# Altium schematic sheet Encoder.SchDoc
size A
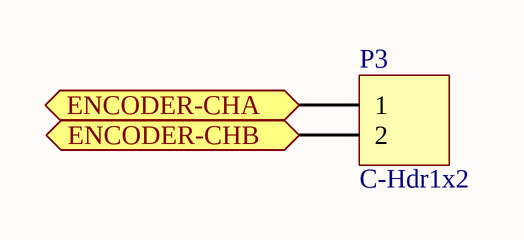
[diagram p0: Encoder.SchDoc]

## Parts
P3  C-Hdr1x2  [HDR1X2_LGE1.0]

## Ports
ENCODER-CHA (out), ENCODER-CHB (out)

## Nets
ENCODER-CHA: P3.1 ; port ENCODER-CHA
ENCODER-CHB: P3.2 ; port ENCODER-CHB

## Library data of the parts
P3 = C-Hdr1x2: Header, 2-Pin; LatestRevisionDate: 17-Jul-2002; LatestRevisionNote: Re-released for DXP Platform.; Publisher: Altium Limited